# Altium schematic sheet FlatSat-PC-104.SchDoc
size A4
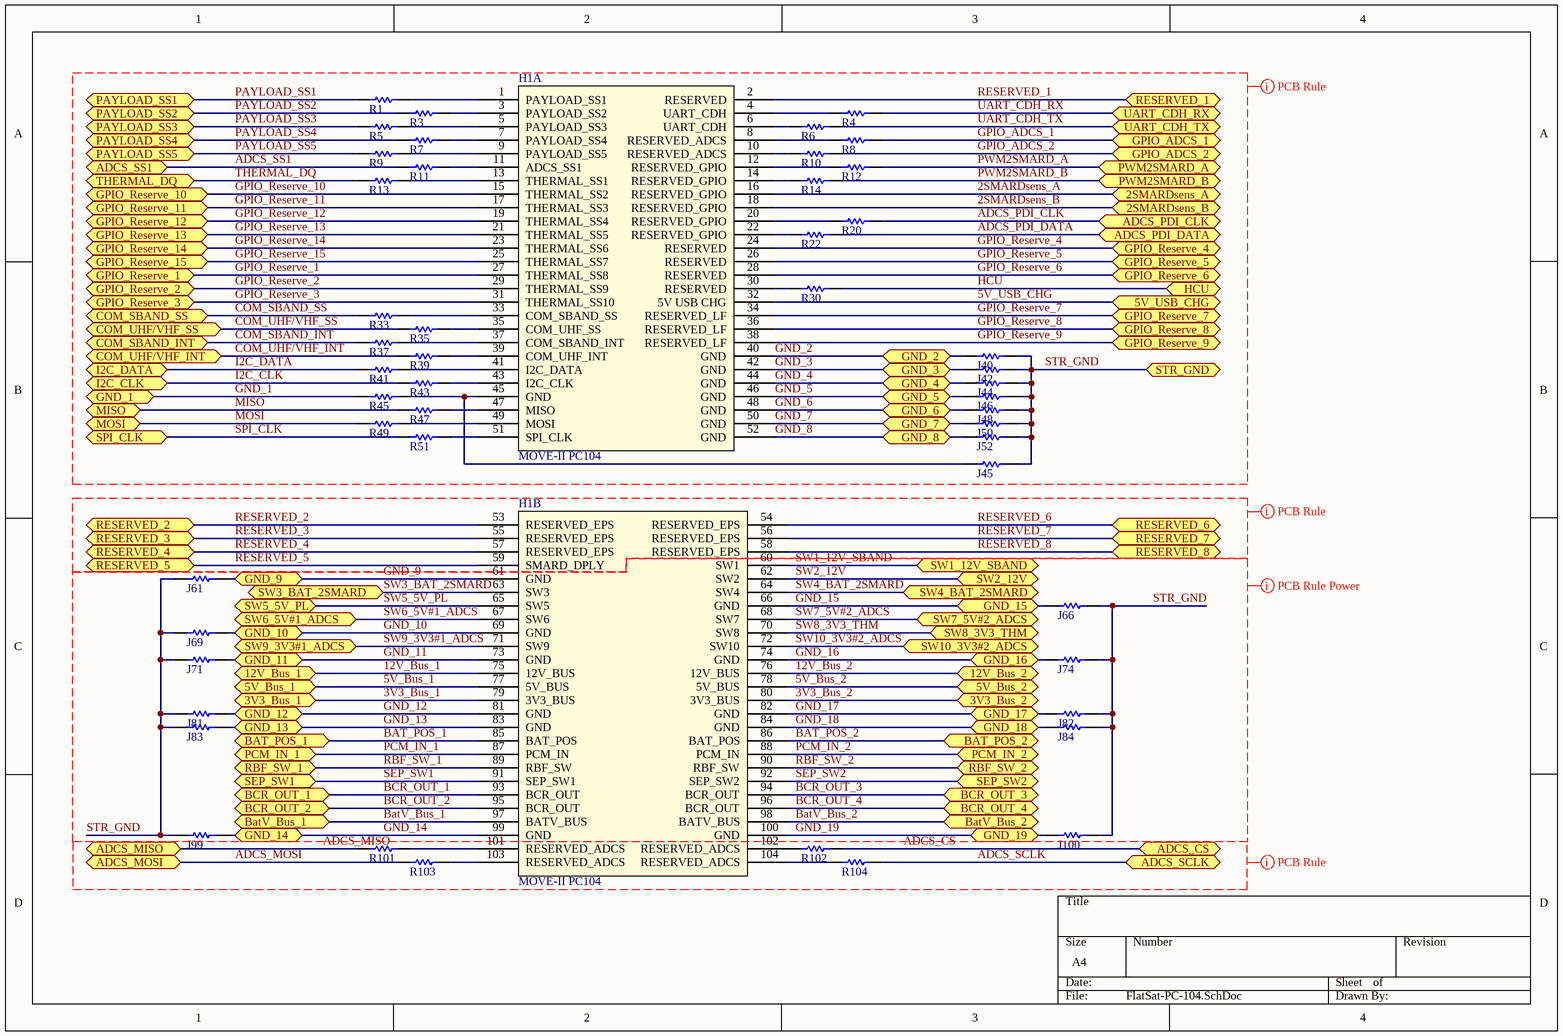
[diagram p0: FlatSat-PC-104.SchDoc]

## Parts
H1  MOVE-II PC104  [EPS]  (parts A,B of 2)
J40  CRCW06030000Z0EA  [RESC1609X55X30ML10T20]  (value not drawn)
J42  CRCW06030000Z0EA  [RESC1609X55X30ML10T20]  (value not drawn)
J44  CRCW06030000Z0EA  [RESC1609X55X30ML10T20]  (value not drawn)
J45  CRCW06030000Z0EA  [RESC1609X55X30ML10T20]  (value not drawn)
J46  CRCW06030000Z0EA  [RESC1609X55X30ML10T20]  (value not drawn)
J48  CRCW06030000Z0EA  [RESC1609X55X30ML10T20]  (value not drawn)
J50  CRCW06030000Z0EA  [RESC1609X55X30ML10T20]  (value not drawn)
J52  CRCW06030000Z0EA  [RESC1609X55X30ML10T20]  (value not drawn)
J61  CRCW06030000Z0EA  [RESC1609X55X30ML10T20]  (value not drawn)
J66  CRCW06030000Z0EA  [RESC1609X55X30ML10T20]  (value not drawn)
J69  CRCW06030000Z0EA  [RESC1609X55X30ML10T20]  (value not drawn)
J71  CRCW06030000Z0EA  [RESC1609X55X30ML10T20]  (value not drawn)
J74  CRCW06030000Z0EA  [RESC1609X55X30ML10T20]  (value not drawn)
J81  CRCW06030000Z0EA  [RESC1609X55X30ML10T20]  (value not drawn)
J82  CRCW06030000Z0EA  [RESC1609X55X30ML10T20]  (value not drawn)
J83  CRCW06030000Z0EA  [RESC1609X55X30ML10T20]  (value not drawn)
J84  CRCW06030000Z0EA  [RESC1609X55X30ML10T20]  (value not drawn)
J99  CRCW06030000Z0EA  [RESC1609X55X30ML10T20]  (value not drawn)
J100  CRCW06030000Z0EA  [RESC1609X55X30ML10T20]  (value not drawn)
R1  CRCW06030000Z0EA  [RESC1609X55X30ML10T20]  (value not drawn)
R3  CRCW06030000Z0EA  [RESC1609X55X30ML10T20]  (value not drawn)
R4  CRCW06030000Z0EA  [RESC1609X55X30ML10T20]  (value not drawn)
R5  CRCW06030000Z0EA  [RESC1609X55X30ML10T20]  (value not drawn)
R6  CRCW06030000Z0EA  [RESC1609X55X30ML10T20]  (value not drawn)
R7  CRCW06030000Z0EA  [RESC1609X55X30ML10T20]  (value not drawn)
R8  CRCW06030000Z0EA  [RESC1609X55X30ML10T20]  (value not drawn)
R9  CRCW06030000Z0EA  [RESC1609X55X30ML10T20]  (value not drawn)
R10  CRCW06030000Z0EA  [RESC1609X55X30ML10T20]  (value not drawn)
R11  CRCW06030000Z0EA  [RESC1609X55X30ML10T20]  (value not drawn)
R12  CRCW06030000Z0EA  [RESC1609X55X30ML10T20]  (value not drawn)
R13  CRCW06030000Z0EA  [RESC1609X55X30ML10T20]  (value not drawn)
R14  CRCW06030000Z0EA  [RESC1609X55X30ML10T20]  (value not drawn)
R20  CRCW06030000Z0EA  [RESC1609X55X30ML10T20]  (value not drawn)
R22  CRCW06030000Z0EA  [RESC1609X55X30ML10T20]  (value not drawn)
R30  CRCW06030000Z0EA  [RESC1609X55X30ML10T20]  (value not drawn)
R33  CRCW06030000Z0EA  [RESC1609X55X30ML10T20]  (value not drawn)
R35  CRCW06030000Z0EA  [RESC1609X55X30ML10T20]  (value not drawn)
R37  CRCW06030000Z0EA  [RESC1609X55X30ML10T20]  (value not drawn)
R39  CRCW06030000Z0EA  [RESC1609X55X30ML10T20]  (value not drawn)
R41  CRCW06030000Z0EA  [RESC1609X55X30ML10T20]  (value not drawn)
R43  CRCW06030000Z0EA  [RESC1609X55X30ML10T20]  (value not drawn)
R45  CRCW06030000Z0EA  [RESC1609X55X30ML10T20]  (value not drawn)
R47  CRCW06030000Z0EA  [RESC1609X55X30ML10T20]  (value not drawn)
R49  CRCW06030000Z0EA  [RESC1609X55X30ML10T20]  (value not drawn)
R51  CRCW06030000Z0EA  [RESC1609X55X30ML10T20]  (value not drawn)
R101  CRCW06030000Z0EA  [RESC1609X55X30ML10T20]  (value not drawn)
R102  CRCW06030000Z0EA  [RESC1609X55X30ML10T20]  (value not drawn)
R103  CRCW06030000Z0EA  [RESC1609X55X30ML10T20]  (value not drawn)
R104  CRCW06030000Z0EA  [RESC1609X55X30ML10T20]  (value not drawn)

## Ports
2SMARDsens_A (bidir), 2SMARDsens_B (bidir), 3V3_Bus_1 (bidir), 3V3_Bus_2 (bidir), 5V_Bus_1 (bidir), 5V_Bus_2 (bidir), 5V_USB_CHG (bidir), 12V_Bus_1 (bidir), 12V_Bus_2 (bidir), ADCS_CS (bidir), ADCS_MISO (bidir), ADCS_MOSI (bidir), ADCS_PDI_CLK (bidir), ADCS_PDI_DATA (bidir), ADCS_SCLK (bidir), ADCS_SS1 (bidir), BAT_POS_1 (bidir), BAT_POS_2 (bidir), BatV_Bus_1 (bidir), BatV_Bus_2 (bidir), BCR_OUT_1 (bidir), BCR_OUT_2 (bidir), BCR_OUT_3 (bidir), BCR_OUT_4 (bidir), COM_SBAND_INT (bidir), COM_SBAND_SS (bidir), COM_UHF/VHF_INT (bidir), COM_UHF/VHF_SS (bidir), GND_1 (bidir), GND_2 (bidir), GND_3 (bidir), GND_4 (bidir), GND_5 (bidir), GND_6 (bidir), GND_7 (bidir), GND_8 (bidir), GND_9 (bidir), GND_10 (bidir), GND_11 (bidir), GND_12 (bidir), GND_13 (bidir), GND_14 (bidir), GND_15 (bidir), GND_16 (bidir), GND_17 (bidir), GND_18 (bidir), GND_19 (bidir), GPIO_ADCS_1 (bidir), GPIO_ADCS_2 (bidir), GPIO_Reserve_1 (bidir), GPIO_Reserve_2 (bidir), GPIO_Reserve_3 (bidir), GPIO_Reserve_4 (bidir), GPIO_Reserve_5 (bidir), GPIO_Reserve_6 (bidir), GPIO_Reserve_7 (bidir), GPIO_Reserve_8 (bidir), GPIO_Reserve_9 (bidir), GPIO_Reserve_10 (bidir), GPIO_Reserve_11 (bidir), GPIO_Reserve_12 (bidir), GPIO_Reserve_13 (bidir), GPIO_Reserve_14 (bidir), GPIO_Reserve_15 (bidir), HCU (bidir), I2C_CLK (bidir), I2C_DATA (bidir), MISO (bidir), MOSI (bidir), PAYLOAD_SS1 (bidir), PAYLOAD_SS2 (bidir), PAYLOAD_SS3 (bidir), PAYLOAD_SS4 (bidir), PAYLOAD_SS5 (bidir), PCM_IN_1 (bidir), PCM_IN_2 (bidir), PWM2SMARD_A (bidir), PWM2SMARD_B (bidir), RBF_SW_1 (bidir), RBF_SW_2 (bidir), RESERVED_1 (bidir), RESERVED_2 (bidir), RESERVED_3 (bidir), RESERVED_4 (bidir), RESERVED_5 (bidir), RESERVED_6 (bidir), RESERVED_7 (bidir), RESERVED_8 (bidir), SEP_SW1 (bidir), SEP_SW2 (bidir), SPI_CLK (bidir), STR_GND (bidir), SW1_12V_SBAND (bidir), SW2_12V (bidir), SW3_BAT_2SMARD (bidir), SW4_BAT_2SMARD (bidir), SW5_5V_PL (bidir), SW6_5V#1_ADCS (bidir), SW7_5V#2_ADCS (bidir), SW8_3V3_THM (bidir), SW9_3V3#1_ADCS (bidir), SW10_3V3#2_ADCS (bidir), THERMAL_DQ (bidir), UART_CDH_RX (bidir), UART_CDH_TX (bidir)

## Nets
2SMARDsens_A: H1.16(RESERVED_GPIO) ; port 2SMARDsens_A
2SMARDsens_B: H1.18(RESERVED_GPIO) ; port 2SMARDsens_B
3V3_Bus_1: H1.79(3V3_BUS) ; port 3V3_Bus_1
3V3_Bus_2: H1.80(3V3_BUS) ; port 3V3_Bus_2
5V_Bus_1: H1.77(5V_BUS) ; port 5V_Bus_1
5V_Bus_2: H1.78(5V_BUS) ; port 5V_Bus_2
5V_USB_CHG: H1.32(5V_USB_CHG) ; port 5V_USB_CHG
12V_Bus_1: H1.75(12V_BUS) ; port 12V_Bus_1
12V_Bus_2: H1.76(12V_BUS) ; port 12V_Bus_2
ADCS_CS: R102.1 ; port ADCS_CS
ADCS_MISO: R101.2 ; port ADCS_MISO
ADCS_MOSI: R103.1 ; port ADCS_MOSI
ADCS_PDI_CLK: R20.2 ; port ADCS_PDI_CLK
ADCS_PDI_DATA: R22.2 ; port ADCS_PDI_DATA
ADCS_SCLK: R104.2 ; port ADCS_SCLK
ADCS_SS1: R11.1 ; port ADCS_SS1
BAT_POS_1: H1.85(BAT_POS) ; port BAT_POS_1
BAT_POS_2: H1.86(BAT_POS) ; port BAT_POS_2
BatV_Bus_1: H1.97(BATV_BUS) ; port BatV_Bus_1
BatV_Bus_2: H1.98(BATV_BUS) ; port BatV_Bus_2
BCR_OUT_1: H1.93(BCR_OUT) ; port BCR_OUT_1
BCR_OUT_2: H1.95(BCR_OUT) ; port BCR_OUT_2
BCR_OUT_3: H1.94(BCR_OUT) ; port BCR_OUT_3
BCR_OUT_4: H1.96(BCR_OUT) ; port BCR_OUT_4
COM_SBAND_INT: R37.1 ; port COM_SBAND_INT
COM_SBAND_SS: R33.1 ; port COM_SBAND_SS
COM_UHF/VHF_INT: R39.1 ; port COM_UHF/VHF_INT
COM_UHF/VHF_SS: R35.2 ; port COM_UHF/VHF_SS
GND_1: R45.1 ; port GND_1
GND_2: H1.40(GND) J40.1 ; port GND_2
GND_3: H1.42(GND) J42.1 ; port GND_3
GND_4: H1.44(GND) J44.1 ; port GND_4
GND_5: H1.46(GND) J46.1 ; port GND_5
GND_6: H1.48(GND) J48.1 ; port GND_6
GND_7: H1.50(GND) J50.1 ; port GND_7
GND_8: H1.52(GND) J52.1 ; port GND_8
GND_9: H1.61(GND) J61.2 ; port GND_9
GND_10: H1.69(GND) J69.2 ; port GND_10
GND_11: H1.73(GND) J71.2 ; port GND_11
GND_12: H1.81(GND) J81.2 ; port GND_12
GND_13: H1.83(GND) J83.2 ; port GND_13
GND_14: H1.99(GND) J99.2 ; port GND_14
GND_15: H1.66(GND) J66.1 ; port GND_15
GND_16: H1.74(GND) J74.1 ; port GND_16
GND_17: H1.82(GND) J82.1 ; port GND_17
GND_18: H1.84(GND) J84.1 ; port GND_18
GND_19: H1.100(GND) J100.1 ; port GND_19
GPIO_ADCS_1: R8.2 ; port GPIO_ADCS_1
GPIO_ADCS_2: R10.2 ; port GPIO_ADCS_2
GPIO_Reserve_1: H1.27(THERMAL_SS8) ; port GPIO_Reserve_1
GPIO_Reserve_2: H1.29(THERMAL_SS9) ; port GPIO_Reserve_2
GPIO_Reserve_3: H1.31(THERMAL_SS10) ; port GPIO_Reserve_3
GPIO_Reserve_4: H1.24(RESERVED) ; port GPIO_Reserve_4
GPIO_Reserve_5: H1.26(RESERVED) ; port GPIO_Reserve_5
GPIO_Reserve_6: H1.28(RESERVED) ; port GPIO_Reserve_6
GPIO_Reserve_7: H1.34(RESERVED_LF) ; port GPIO_Reserve_7
GPIO_Reserve_8: H1.36(RESERVED_LF) ; port GPIO_Reserve_8
GPIO_Reserve_9: H1.38(RESERVED_LF) ; port GPIO_Reserve_9
GPIO_Reserve_10: H1.15(THERMAL_SS2) ; port GPIO_Reserve_10
GPIO_Reserve_11: H1.17(THERMAL_SS3) ; port GPIO_Reserve_11
GPIO_Reserve_12: H1.19(THERMAL_SS4) ; port GPIO_Reserve_12
GPIO_Reserve_13: H1.21(THERMAL_SS5) ; port GPIO_Reserve_13
GPIO_Reserve_14: H1.23(THERMAL_SS6) ; port GPIO_Reserve_14
GPIO_Reserve_15: H1.25(THERMAL_SS7) ; port GPIO_Reserve_15
HCU: R30.2 ; port HCU
I2C_CLK: R43.1 ; port I2C_CLK
I2C_DATA: R41.1 ; port I2C_DATA
MISO: R47.1 ; port MISO
MOSI: R49.1 ; port MOSI
PAYLOAD_SS1: R1.1 ; port PAYLOAD_SS1
PAYLOAD_SS2: R3.1 ; port PAYLOAD_SS2
PAYLOAD_SS3: R5.1 ; port PAYLOAD_SS3
PAYLOAD_SS4: R7.1 ; port PAYLOAD_SS4
PAYLOAD_SS5: R9.1 ; port PAYLOAD_SS5
PCM_IN_1: H1.87(PCM_IN) ; port PCM_IN_1
PCM_IN_2: H1.88(PCM_IN) ; port PCM_IN_2
PWM2SMARD_A: R12.2 ; port PWM2SMARD_A
PWM2SMARD_B: R14.2 ; port PWM2SMARD_B
RBF_SW_1: H1.89(RBF_SW) ; port RBF_SW_1
RBF_SW_2: H1.90(RBF_SW) ; port RBF_SW_2
RESERVED_1: H1.2(RESERVED) ; port RESERVED_1
RESERVED_2: H1.53(RESERVED_EPS) ; port RESERVED_2
RESERVED_3: H1.55(RESERVED_EPS) ; port RESERVED_3
RESERVED_4: H1.57(RESERVED_EPS) ; port RESERVED_4
RESERVED_5: H1.59(SMARD_DPLY) ; port RESERVED_5
RESERVED_6: H1.54(RESERVED_EPS) ; port RESERVED_6
RESERVED_7: H1.56(RESERVED_EPS) ; port RESERVED_7
RESERVED_8: H1.58(RESERVED_EPS) ; port RESERVED_8
SEP_SW1: H1.91(SEP_SW1) ; port SEP_SW1
SEP_SW2: H1.92(SEP_SW2) ; port SEP_SW2
SPI_CLK: R51.1 ; port SPI_CLK
STR_GND: J40.2 J42.2 J44.2 J45.2 J46.2 J48.2 J50.2 J52.2 J61.1 J66.2 J69.1 J71.1 J74.2 J81.1 J82.2 J83.1 J84.2 J99.1 J100.2 ; port STR_GND
SW1_12V_SBAND: H1.60(SW1) ; port SW1_12V_SBAND
SW2_12V: H1.62(SW2) ; port SW2_12V
SW3_BAT_2SMARD: H1.63(SW3) ; port SW3_BAT_2SMARD
SW4_BAT_2SMARD: H1.64(SW4) ; port SW4_BAT_2SMARD
SW5_5V_PL: H1.65(SW5) ; port SW5_5V_PL
SW6_5V#1_ADCS: H1.67(SW6) ; port SW6_5V#1_ADCS
SW7_5V#2_ADCS: H1.68(SW7) ; port SW7_5V#2_ADCS
SW8_3V3_THM: H1.70(SW8) ; port SW8_3V3_THM
SW9_3V3#1_ADCS: H1.71(SW9) ; port SW9_3V3#1_ADCS
SW10_3V3#2_ADCS: H1.72(SW10) ; port SW10_3V3#2_ADCS
THERMAL_DQ: R13.1 ; port THERMAL_DQ
UART_CDH_RX: R4.2 ; port UART_CDH_RX
UART_CDH_TX: R6.2 ; port UART_CDH_TX
NetH1_1: H1.1(PAYLOAD_SS1) R1.2
NetH1_3: H1.3(PAYLOAD_SS2) R3.2
NetH1_4: H1.4(UART_CDH) R4.1
NetH1_5: H1.5(PAYLOAD_SS3) R5.2
NetH1_6: H1.6(UART_CDH) R6.1
NetH1_7: H1.7(PAYLOAD_SS4) R7.2
NetH1_8: H1.8(RESERVED_ADCS) R8.1
NetH1_9: H1.9(PAYLOAD_SS5) R9.2
NetH1_10: H1.10(RESERVED_ADCS) R10.1
NetH1_11: H1.11(ADCS_SS1) R11.2
NetH1_12: H1.12(RESERVED_GPIO) R12.1
NetH1_13: H1.13(THERMAL_SS1) R13.2
NetH1_14: H1.14(RESERVED_GPIO) R14.1
NetH1_20: H1.20(RESERVED_GPIO) R20.1
NetH1_22: H1.22(RESERVED_GPIO) R22.1
NetH1_30: H1.30(RESERVED) R30.1
NetH1_33: H1.33(COM_SBAND_SS) R33.2
NetH1_35: H1.35(COM_UHF_SS) R35.1
NetH1_37: H1.37(COM_SBAND_INT) R37.2
NetH1_39: H1.39(COM_UHF_INT) R39.2
NetH1_41: H1.41(I2C_DATA) R41.2
NetH1_43: H1.43(I2C_CLK) R43.2
NetH1_45: H1.45(GND) J45.1 R45.2
NetH1_47: H1.47(MISO) R47.2
NetH1_49: H1.49(MOSI) R49.2
NetH1_51: H1.51(SPI_CLK) R51.2
NetH1_101: H1.101(RESERVED_ADCS) R101.1
NetH1_102: H1.102(RESERVED_ADCS) R102.2
NetH1_103: H1.103(RESERVED_ADCS) R103.2
NetH1_104: H1.104(RESERVED_ADCS) R104.1

## Layout directives
rule Clearance Constraint [Clearance = 8mil]; rule Width Constraint [Pref Width = 8mil    Min Width = 8mil    Max Width = 10mil]: 2SMARDsens_A, 2SMARDsens_B, 5V_USB_CHG, ADCS_CS, ADCS_MISO, ADCS_MOSI, ADCS_PDI_CLK, ADCS_PDI_DATA, ADCS_SCLK, ADCS_SS1, COM_SBAND_INT, COM_SBAND_SS, COM_UHF/VHF_INT, COM_UHF/VHF_SS, GND_1, GND_2, GND_3, GND_4, GND_5, GND_6, GND_7, GND_8, GPIO_ADCS_1, GPIO_ADCS_2, GPIO_Reserve_1, GPIO_Reserve_2, GPIO_Reserve_3, GPIO_Reserve_4, GPIO_Reserve_5, GPIO_Reserve_6, GPIO_Reserve_7, GPIO_Reserve_8, GPIO_Reserve_9, GPIO_Reserve_10, GPIO_Reserve_11, GPIO_Reserve_12, GPIO_Reserve_13, GPIO_Reserve_14, GPIO_Reserve_15, HCU, I2C_CLK, I2C_DATA, MISO, MOSI, PAYLOAD_SS1, PAYLOAD_SS2, PAYLOAD_SS3, PAYLOAD_SS4, PAYLOAD_SS5, PWM2SMARD_A, PWM2SMARD_B, RESERVED_1, RESERVED_2, RESERVED_3, RESERVED_4, RESERVED_5, RESERVED_6, RESERVED_7, RESERVED_8, SPI_CLK, STR_GND, THERMAL_DQ, UART_CDH_RX, UART_CDH_TX
rule Clearance Constraint [Clearance = 8mil]; rule Width Constraint [Pref Width = 26mil    Min Width = 8mil    Max Width = 26mil]: 3V3_Bus_1, 3V3_Bus_2, 5V_Bus_1, 5V_Bus_2, 12V_Bus_1, 12V_Bus_2, BAT_POS_1, BAT_POS_2, BatV_Bus_1, BatV_Bus_2, BCR_OUT_1, BCR_OUT_2, BCR_OUT_3, BCR_OUT_4, GND_9, GND_10, GND_11, GND_12, GND_13, GND_14, GND_15, GND_16, GND_17, GND_18, GND_19, PCM_IN_1, PCM_IN_2, RBF_SW_1, RBF_SW_2, SEP_SW1, SEP_SW2, STR_GND, SW1_12V_SBAND, SW2_12V, SW3_BAT_2SMARD, SW4_BAT_2SMARD, SW5_5V_PL, SW6_5V#1_ADCS, SW7_5V#2_ADCS, SW8_3V3_THM, SW9_3V3#1_ADCS, SW10_3V3#2_ADCS

## Library data of the parts
J40 J42 J44-J46 J48 J50 J52 J61 J66 J69 J71 J74 J81-J84 J99 J100 R1 R3-R14 R20 R22 R30 R33 R35 R37 R39 R41 R43 R45 R47 R49 R51 R101-R104 = CMP-2000-03816-1: Manufacturer: Vishay Dale; Part Number: CRCW06030000Z0EA